# Altium schematic sheet PD Controller.SchDoc
size B; SheetNumber: 6; SheetTotal: 8
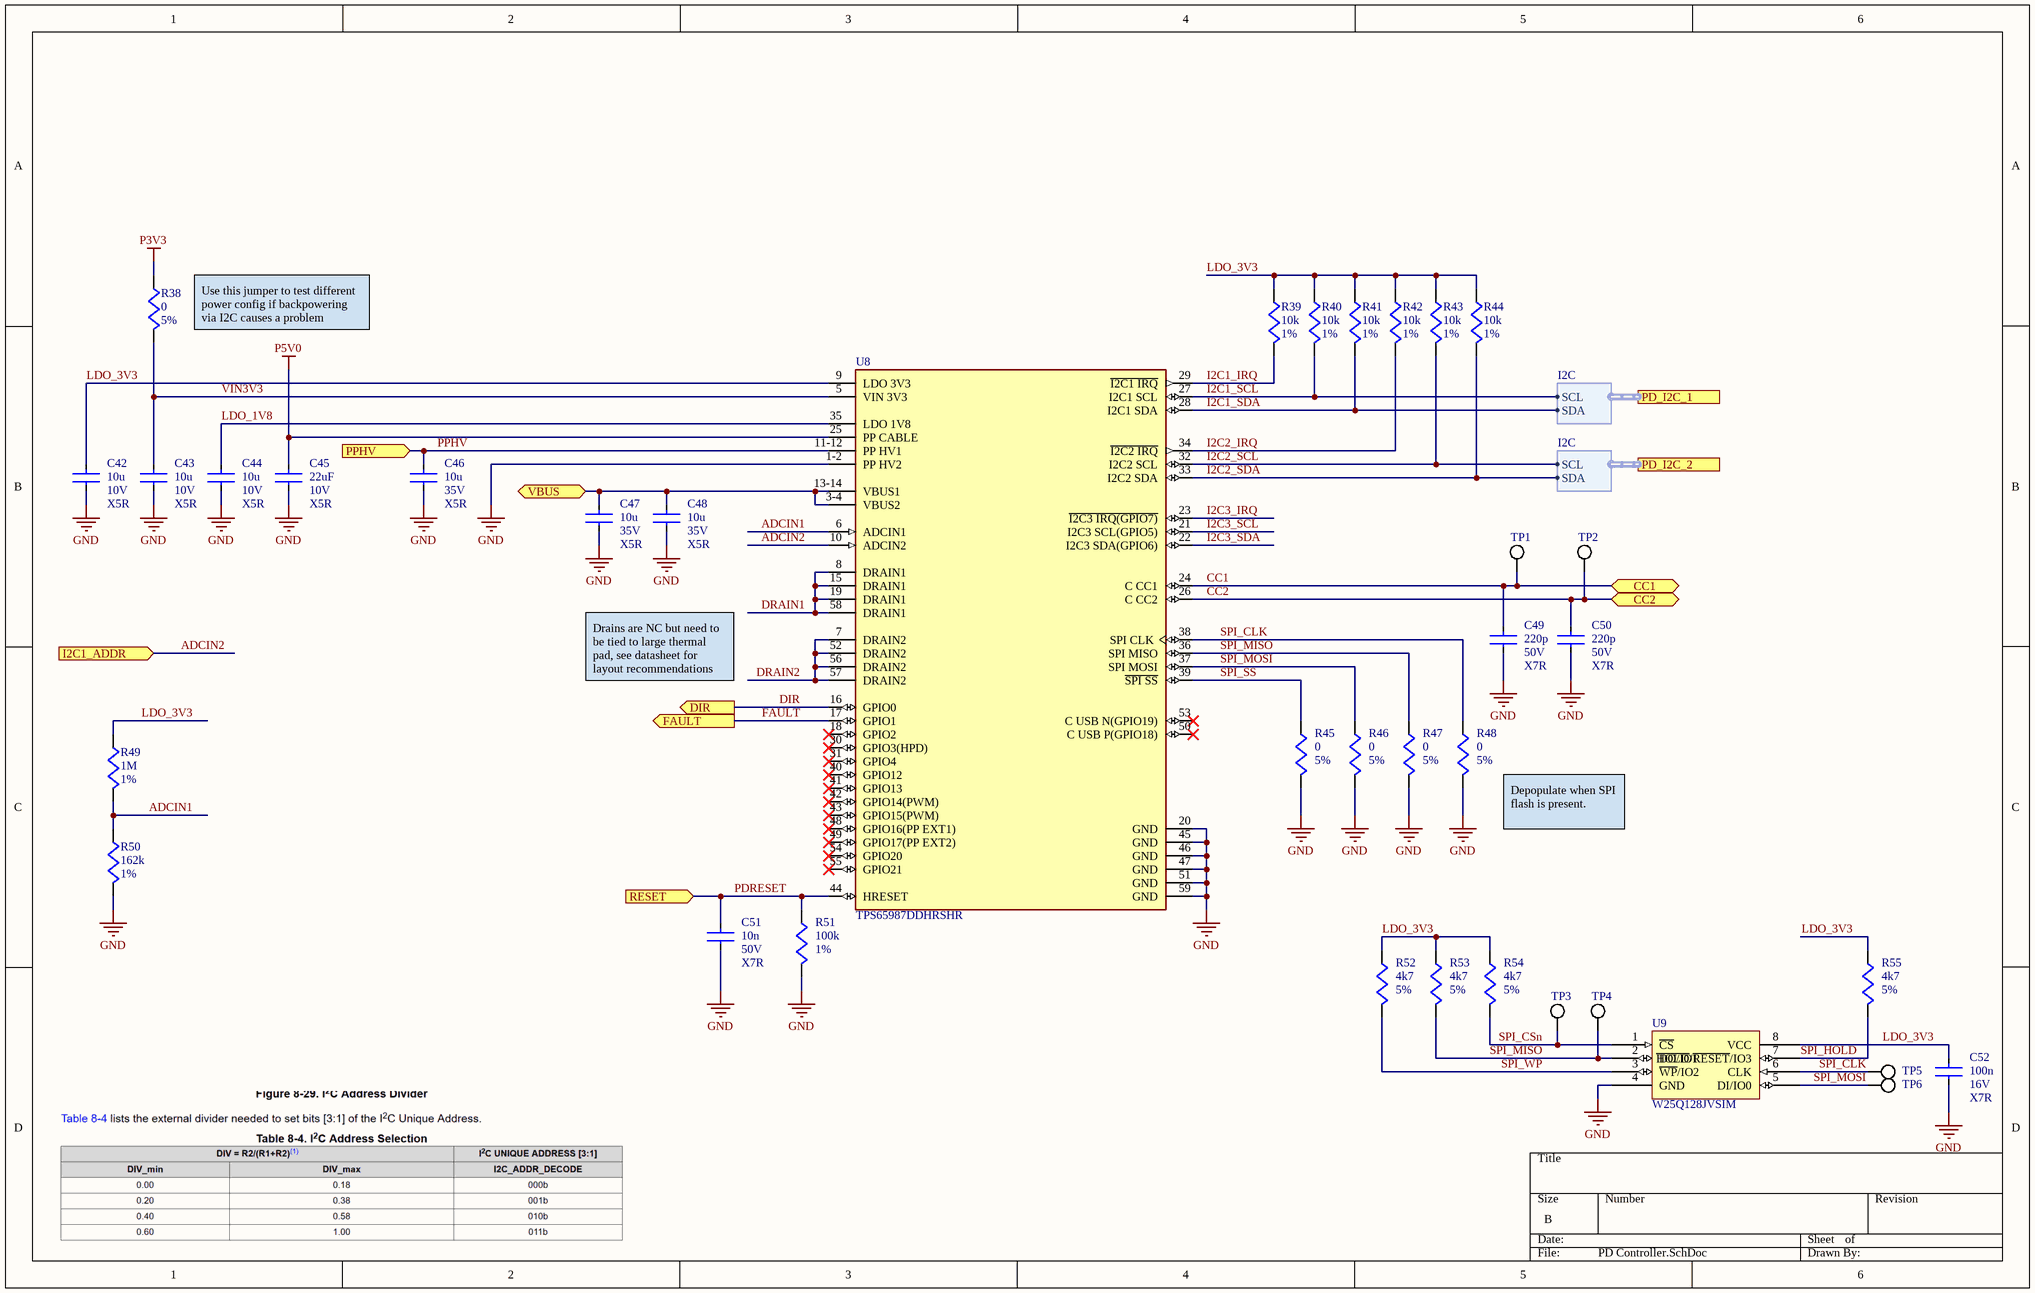
[diagram p0: PD Controller.SchDoc]

## Parts
C42  value 10u  Voltage: 10V  Dielectric: X5R  [CAPC1005X06N]  (hidden comment: 10uF 10V 0402)
C43  value 10u  Voltage: 10V  Dielectric: X5R  [CAPC1005X06N]  (hidden comment: 10uF 10V 0402)
C44  value 10u  Voltage: 10V  Dielectric: X5R  [CAPC1005X06N]  (hidden comment: 10uF 10V 0402)
C45  value 22uF  Voltage: 10V  Dielectric: X5R  [CAPC1608X08N]  (hidden comment: 22uF 10V 0603 X5R)
C46  value 10u  Voltage: 35V  Dielectric: X5R  [CAPC1608X08N]  (hidden comment: 10uF 35V 0603)
C47  value 10u  Voltage: 35V  Dielectric: X5R  [CAPC1608X08N]  (hidden comment: 10uF 35V 0603)
C48  value 10u  Voltage: 35V  Dielectric: X5R  [CAPC1608X08N]  (hidden comment: 10uF 35V 0603)
C49  value 220p  Voltage: 50V  Dielectric: X7R  [CAPC1005X06N]  (hidden comment: 220pF 50V 0402)
C50  value 220p  Voltage: 50V  Dielectric: X7R  [CAPC1005X06N]  (hidden comment: 220pF 50V 0402)
C51  value 10n  Voltage: 50V  Dielectric: X7R  [CAPC1005X06N]  (hidden comment: 10n 50V X7R 0402)
C52  value 100n  Voltage: 16V  Dielectric: X7R  [CAPC1005X06N]  (hidden comment: 100nF 16V 0402)
R38  value 0  Tolerance: 5%  [RESC1005X04M]  (hidden comment: 0 Ohm 1% 0402)
R39  value 10k  Tolerance: 1%  [RESC1005X04M]  (hidden comment: 10k 1% 0402)
R40  value 10k  Tolerance: 1%  [RESC1005X04M]  (hidden comment: 10k 1% 0402)
R41  value 10k  Tolerance: 1%  [RESC1005X04M]  (hidden comment: 10k 1% 0402)
R42  value 10k  Tolerance: 1%  [RESC1005X04M]  (hidden comment: 10k 1% 0402)
R43  value 10k  Tolerance: 1%  [RESC1005X04M]  (hidden comment: 10k 1% 0402)
R44  value 10k  Tolerance: 1%  [RESC1005X04M]  (hidden comment: 10k 1% 0402)
R45  value 0  Tolerance: 5%  [RESC1005X04M]  (hidden comment: 0 Ohm 1% 0402)
R46  value 0  Tolerance: 5%  [RESC1005X04M]  (hidden comment: 0 Ohm 1% 0402)
R47  value 0  Tolerance: 5%  [RESC1005X04M]  (hidden comment: 0 Ohm 1% 0402)
R48  value 0  Tolerance: 5%  [RESC1005X04M]  (hidden comment: 0 Ohm 1% 0402)
R49  value 1M  Tolerance: 1%  [RESC1005X04M]  (hidden comment: 1M 1% 0402)
R50  value 162k  Tolerance: 1%  [RESC1005X04M]  (hidden comment: 162k 1% 0402)
R51  value 100k  Tolerance: 1%  [RESC1005X04M]  (hidden comment: 100k 1% 0402)
R52  value 4k7  Tolerance: 5%  [RESC1005X04M]  (hidden comment: 4.7k 5% 0402)
R53  value 4k7  Tolerance: 5%  [RESC1005X04M]  (hidden comment: 4.7k 5% 0402)
R54  value 4k7  Tolerance: 5%  [RESC1005X04M]  (hidden comment: 4.7k 5% 0402)
R55  value 4k7  Tolerance: 5%  [RESC1005X04M]  (hidden comment: 4.7k 5% 0402)
TP1  45mil Test Point  [45mil Test Point Footprint]  (value not drawn)  (no BOM)
TP2  45mil Test Point  [45mil Test Point Footprint]  (value not drawn)  (no BOM)
TP3  45mil Test Point  [45mil Test Point Footprint]  (value not drawn)  (no BOM)
TP4  45mil Test Point  [45mil Test Point Footprint]  (value not drawn)  (no BOM)
TP5  45mil Test Point  [45mil Test Point Footprint]  (value not drawn)  (no BOM)
TP6  45mil Test Point  [45mil Test Point Footprint]  (value not drawn)  (no BOM)
U8  TPS65987DDHRSHR  [FP-RSH0056E-MFG]
U9  W25Q128JVSIM  [SOIC127P790X216-8N]

## Ports
CC1 (bidir, see DFP[3A]), CC2 (bidir, see DFP[3A]), DIR (out, see DFP[3B]), FAULT (out, see DFP[2A]), I2C1_ADDR (in, see DFP[2A]), PD_I2C_1 (harness i2C, see DFP[2A]), PD_I2C_2 (harness I2C, see DFP[2B]), PPHV (in, see DFP[2B], PD Regulator[6C]), RESET (in, see DFP[2A]), VBUS (bidir, see DFP[3A])

## Harnesses
I2C: SCL, SDA

## Nets
GND: C42.2 C43.2 C44.2 C45.2 C46.2 C47.2 C48.2 C49.2 C50.2 C51.2 C52.2 R45.2 R46.2 R47.2 R48.2 R50.2 R51.2 U8.1-2(PP_HV2) U8.20(GND) U8.45(GND) U8.46(GND) U8.47(GND) U8.51(GND) U8.59(GND) U9.4(GND)
P3V3: R38.1
P5V0: C45.1 U8.25(PP_CABLE)
ADCIN1: R49.2 R50.1 U8.6(ADCIN1)
ADCIN2: U8.10(ADCIN2) ; port I2C1_ADDR
CC1: C49.1 TP1.0 U8.24(C_CC1) ; port CC1
CC2: C50.1 TP2.0 U8.26(C_CC2) ; port CC2
DIR: U8.16(GPIO0) ; port DIR
DRAIN1: U8.8(DRAIN1) U8.15(DRAIN1) U8.19(DRAIN1) U8.58(DRAIN1)
DRAIN2: U8.7(DRAIN2) U8.52(DRAIN2) U8.56(DRAIN2) U8.57(DRAIN2)
FAULT: U8.17(GPIO1) ; port FAULT
I2C1_IRQ: R39.2 U8.29(~{I2C1_IRQ})
I2C1_SCL: R40.2 U8.27(I2C1_SCL) ; port PD_I2C_1.SCL
I2C1_SDA: R41.2 U8.28(I2C1_SDA) ; port PD_I2C_1.SDA
I2C2_IRQ: R42.2 U8.34(~{I2C2_IRQ})
I2C2_SCL: R43.2 U8.32(I2C2_SCL) ; port PD_I2C_2.SCL
I2C2_SDA: R44.2 U8.33(I2C2_SDA) ; port PD_I2C_2.SDA
I2C3_IRQ: U8.23(~{I2C3_IRQ(GPIO7)})
I2C3_SCL: U8.21(I2C3_SCL(GPIO5))
I2C3_SDA: U8.22(I2C3_SDA(GPIO6))
LDO_1V8: C44.1 U8.35(LDO_1V8)
LDO_3V3: C42.1 C52.1 R39.1 R40.1 R41.1 R42.1 R43.1 R44.1 R49.1 R52.1 R53.1 R54.1 R55.1 U8.9(LDO_3V3) U9.8(VCC)
PDRESET: C51.1 R51.1 U8.44(HRESET) ; port RESET
PPHV: C46.1 U8.11-12(PP_HV1) ; port PPHV
SPI_CLK: R48.1 TP5.0 U8.38(SPI_CLK) U9.6(CLK)
SPI_CSn: R54.2 TP3.0 U9.1(~{CS})
SPI_HOLD: R55.2 U9.7(~{HOLD}/~{RESET}/IO3)
SPI_MISO: R47.1 R53.2 TP4.0 U8.36(SPI_MISO) U9.2(DO/IO1)
SPI_MOSI: R46.1 TP6.0 U8.37(SPI_MOSI) U9.5(DI/IO0)
SPI_SS: R45.1 U8.39(~{SPI_SS})
SPI_WP: R52.2 U9.3(~{WP}/IO2)
VBUS: C47.1 C48.1 U8.3-4(VBUS2) U8.13-14(VBUS1) ; port VBUS
VIN3V3: C43.1 R38.2 U8.5(VIN_3V3)

Not connected (* = marked no-connect by the designer): U8 18(GPIO2)* 30(GPIO3(HPD))* 31(GPIO4)* 40(GPIO12)* 41(GPIO13)* 42(GPIO14(PWM))* 43(GPIO15(PWM))* 48(GPIO16(PP_EXT1))* 49(GPIO17(PP_EXT2))* 50(C_USB_P(GPIO18))* 53(C_USB_N(GPIO19))* 54(GPIO20)* 55(GPIO21)*

## Notes on the sheet
- (near R38) Use this jumper to test different power config if backpowering via I2C causes a problem
- Drains are NC but need to be tied to large thermal pad, see datasheet for layout recommendations
- (near R48) Depopulate when SPI flash is present.

## Library data of the parts
C42-C44 = CMP-001-00084-2: 10uF 10V 0402 20% X5R CAP MLCC; Footprint: 0402; LCSC Part #: C527590
C45 = CMP-001-00110-1: 10V 22uF X5R ±20% 0603 Multilayer Ceramic Capacitors MLCC - SMD/SMT ROHS; LCSC Part #: C86295; Package: 0603
C46-C48 = CMP-001-00102-2: 35V 10uF X5R ±20% 0603 Multilayer Ceramic Capacitors MLCC - SMD/SMT ROHS; LCSC Part #: C194427; Package: 0603
C49 C50 = CMP-001-00115-1: 50V 220pF X7R ±10% 0402 Multilayer Ceramic Capacitors MLCC - SMD/SMT ROHS; LCSC Part #: C107025; Package: 0402
C51 = CMP-001-00116-1: 50V 10nF X7R ±10% 0402 Multilayer Ceramic Capacitors MLCC - SMD/SMT ROHS; LCSC Part #: C60133; Package: 0402
C52 = CMP-001-00088-2: 16V 100nF X7R ±10% 0402 Multilayer Ceramic Capacitors MLCC - SMD/SMT ROHS; LCSC Part #: C1525; Package: 0402
R38 R45-R48 = CMP-009-00232-1: 62.5mW Thick Film Resistors 50V ±5% 0Ω 0402 Chip Resistor - Surface Mount ROHS; Package: 0402; LCSC Part #: C60485
R39-R44 = CMP-009-00187-2: 62.5mW Thick Film Resistors 50V ±100ppm/℃ ±1% 10kΩ 0402 Chip Resistor - Surface Mount ROHS; Package: 0402; LCSC Part #: C60490
R49 = CMP-009-00240-1: 62.5mW Thick Film Resistors 50V ±100ppm/℃ ±1% 1MΩ 0402 Chip Resistor - Surface Mount ROHS; LCSC Part #: C138033; Package: 0402
R50 = CMP-009-00217-3: 62.5mW Thick Film Resistors 50V ±100ppm/℃ ±1% 162kΩ 0402 Chip Resistor - Surface Mount ROHS; LCSC Part #: C54068; Package: 0402
R51 = CMP-009-00218-2: 62.5mW Thick Film Resistors 50V ±100ppm/℃ ±1% 100kΩ 0402 Chip Resistor - Surface Mount ROHS; Package: 0402; LCSC Part #: C60491
R52-R55 = CMP-009-00197-2: 62.5mW Thick Film Resistors 50V ±100ppm/℃ ±5% 4.7kΩ 0402 Chip Resistor - Surface Mount ROHS; Package: 0402; LCSC Part #: C105870
TP1-TP6 = CMP-001-0001-7: 45mil SMD test point
U8 = CMP-019-00062-1: USB Type-C™ and USB PD controller with integrated power switches 56-VQFN -10 to 75
U9 = CMP-019-00052-3: NOR Flash Serial (SPI, Dual SPI, Quad SPI) 3V/3.3V 128M-bit 16M x 8 6ns 8-Pin SOIC Tube